# EAGLE schematic ESP32_School_Prototype (EAGLE 9.2.2)

## Sheet 1 of 8: ESP32
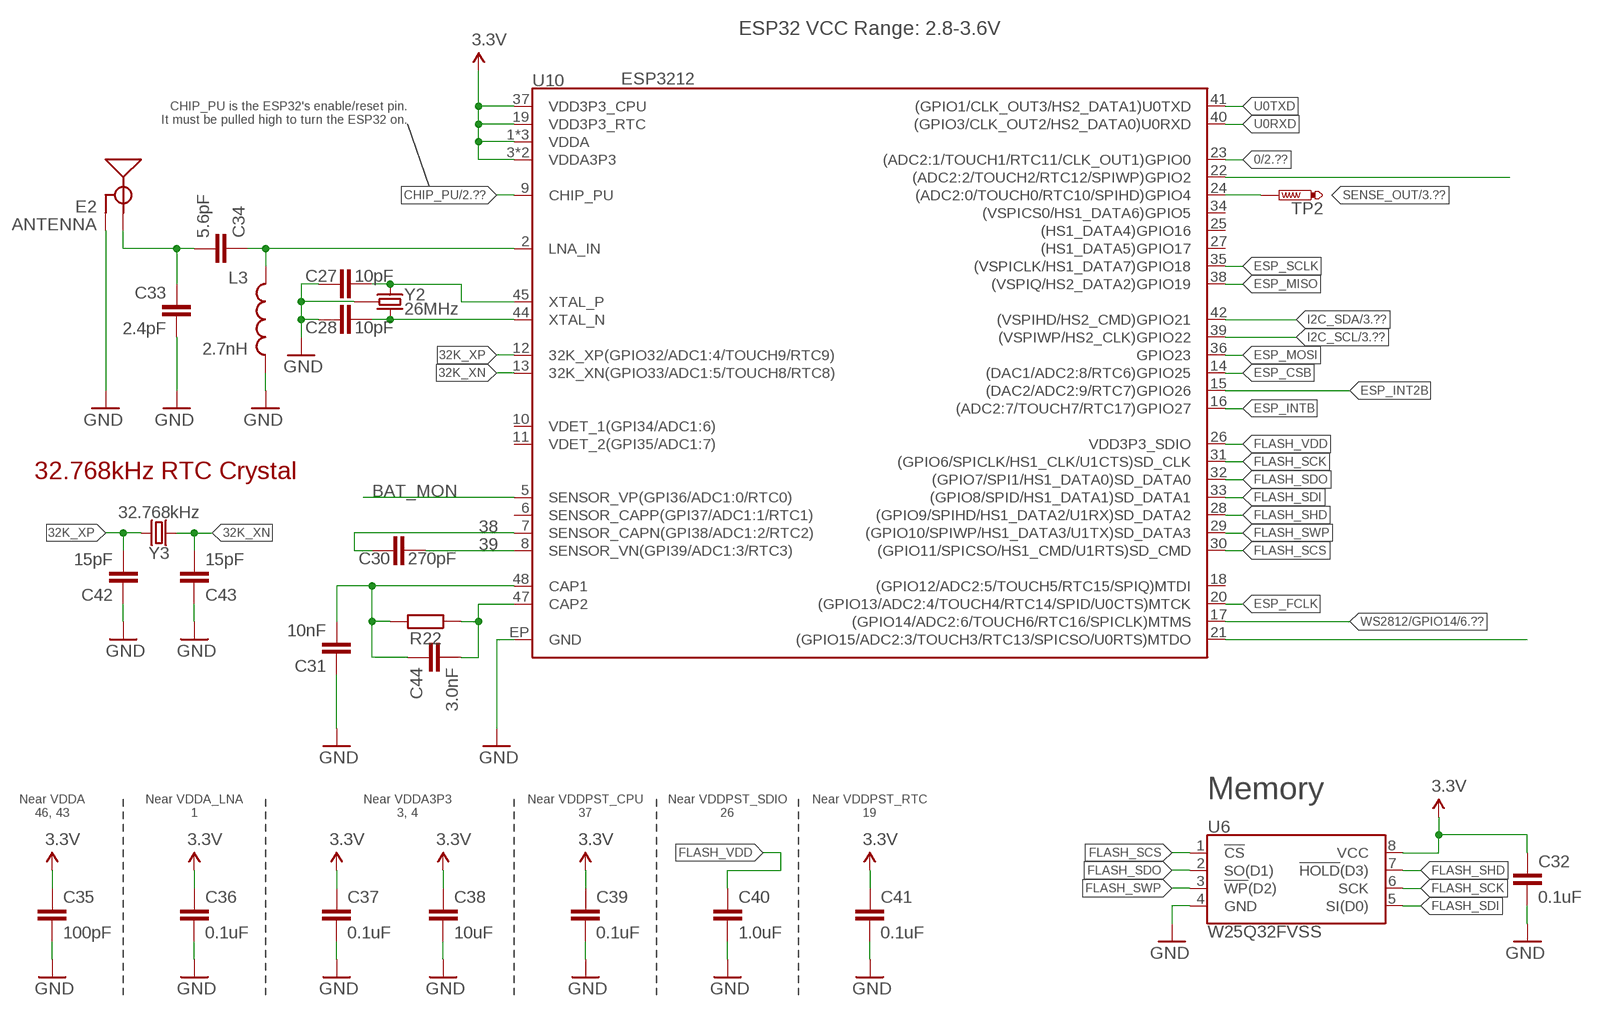
[diagram p0: schematic, sheet 1]

### Parts
C27  10pF  10PF-0603-50V-5%  [0603]
C28  10pF  10PF-0603-50V-5%  [0603]
C30  270pF  270PF-50V-5%(0603)  [0603]
C31  10nF  10NF-0603-50V-10%  [0603]
C32  0.1uF  0.1UF-0402-16V-10%  [0402]
C33  2.4pF  2.4PF-0603-50V-5%  [0603]
C34  5.6pF  5.6PF-50V-5%(0603)  [0603]
C35  100pF  100PF-0603-50V-5%  [0603]
C36  0.1uF  0.1UF-0603-25V-(+80/-20%)  [0603]
C37  0.1uF  0.1UF-0603-25V-(+80/-20%)  [0603]
C38  10uF  10UF-0603-6.3V-20%  [0603]
C39  0.1uF  0.1UF-0402-16V-10%  [0402]
C40  1.0uF  1.0UF-0603-16V-10%  [0603]
C41  0.1uF  0.1UF-0603-25V-(+80/-20%)  [0603]
C42  15pF  15PF-0603-50V-5%  [0603]
C43  15pF  15PF-0603-50V-5%  [0603]
C44  3.0nF  3.0NF-0603-50V-5%  [0603]
E2  ANTENNA  ANTENNATRACE-TUNED  [TRACE_ANTENNA_2.4GHZ_25.7MM_TUNED]
L3  2.7nH  INDUCTOR0603  [0603]
R22  20k  R-EU_R0402  [R0402]
TP2  PTR1TP10SQ  [TP10SQ]
U6  W25Q32FVSS  [SOIC-8]
U10  ESP3212  [QFN48-0.4MM]
Y2  26MHz  CRYSTAL-GROUNDED3.2X2.5  [CRYSTAL-SMD-3.2X2.5]
Y3  32.768kHz  CRYSTAL-32.768KHZSMD-3.2X1.5  [CRYSTAL-SMD-3.2X1.5MM]

### Nets
0: U10.23((ADC2:1/TOUCH1/RTC11/CLK_OUT1)GPIO0) ; also sheet 2
3.3V: C32.1 C35.1 C36.1 C37.1 C38.1 C39.1 C41.1 U6.8(VCC) U10.1(VDDA) U10.3(VDDA3P3) U10.4(VDDA3P3) U10.19(VDD3P3_RTC) U10.37(VDD3P3_CPU) U10.43(VDDA) U10.46(VDDA) ; also sheet 2,3,4,5,6,7
32K_XN: C43.2 U10.13(32K_XN(GPIO33/ADC1:5/TOUCH8/RTC8)) Y3.P$2
32K_XP: C42.2 U10.12(32K_XP(GPIO32/ADC1:4/TOUCH9/RTC9)) Y3.P$1
38: C30.1 U10.7(SENSOR_CAPN(GPI38/ADC1:2/RTC2))
39: C30.2 U10.8(SENSOR_VN(GPI39/ADC1:3/RTC3))
BAT_MON: U10.5(SENSOR_VP(GPI36/ADC1:0/RTC0)) ; also sheet 5
CAP_10N: C31.2 C44.1 R22.2 U10.48(CAP1)
CHIP_PU: U10.9(CHIP_PU) ; also sheet 2
ESP_CSB: U10.14((DAC1/ADC2:8/RTC6)GPIO25)
ESP_FCLK: U10.20((GPIO13/ADC2:4/TOUCH4/RTC14/SPID/U0CTS)MTCK)
ESP_INT2B: U10.15((DAC2/ADC2:9/RTC7)GPIO26)
ESP_INTB: U10.16((ADC2:7/TOUCH7/RTC17)GPIO27)
ESP_MISO: U10.38((VSPIQ/HS2_DATA2)GPIO19)
ESP_MOSI: U10.36(GPIO23)
ESP_SCLK: U10.35((VSPICLK/HS1_DATA7)GPIO18)
FLASH_SCK: U6.6(SCK) U10.31((GPIO6/SPICLK/HS1_CLK/U1CTS)SD_CLK)
FLASH_SCS: U6.1(!CS!) U10.30((GPIO11/SPICSO/HS1_CMD/U1RTS)SD_CMD)
FLASH_SDI: U6.5(SI(D0)) U10.33((GPIO8/SPID/HS1_DATA1)SD_DATA1)
FLASH_SDO: U6.2(SO(D1)) U10.32((GPIO7/SPI1/HS1_DATA0)SD_DATA0)
FLASH_SHD: U6.7(!HOLD!(D3)) U10.28((GPIO9/SPIHD/HS1_DATA2/U1RX)SD_DATA2)
FLASH_SWP: U6.3(!WP!(D2)) U10.29((GPIO10/SPIWP/HS1_DATA3/U1TX)SD_DATA3)
FLASH_VDD: C40.1 U10.26(VDD3P3_SDIO)
GND: C27.1 C28.1 C31.1 C32.2 C33.2 C35.2 C36.2 C37.2 C38.2 C39.2 C40.2 C41.2 C42.1 C43.1 E2.GND E2.GND2(GND) L3.2 U6.4(GND) U10.EP(GND) Y2.2(GND) Y2.4(GND) ; also sheet 3,4,5,6,7,8
I2C_SCL: U10.39((VSPIWP/HS2_CLK)GPIO22) ; also sheet 3
I2C_SDA: U10.42((VSPIHD/HS2_CMD)GPIO21) ; also sheet 3
LNA_IN: C34.1 L3.1 U10.2(LNA_IN)
N$4: U10.22((ADC2:2/TOUCH2/RTC12/SPIWP)GPIO2)
N$15: U10.21((GPIO15/ADC2:3/TOUCH3/RTC13/SPICSO/U0RTS)MTDO)
N$25: C27.2 U10.45(XTAL_P) Y2.1
N$26: C28.2 U10.44(XTAL_N) Y2.3
N$30: C44.2 R22.1 U10.47(CAP2)
SENSE_OUT: TP2.TP U10.24((ADC2:0/TOUCH0/RTC10/SPIHD)GPIO4) ; also sheet 3
TRACE_ANT1: C33.1 C34.2 E2.ANT(SIGNAL)
U0RXD: U10.40((GPIO3/CLK_OUT2/HS2_DATA0)U0RXD) ; also sheet 7
U0TXD: U10.41((GPIO1/CLK_OUT3/HS2_DATA1)U0TXD) ; also sheet 7
WS2812/GPIO14: U10.17((GPIO14/ADC2:6/TOUCH6/RTC16/SPICLK)MTMS) ; also sheet 6
Unconnected: U10.6(SENSOR_CAPP(GPI37/ADC1:1/RTC1)) U10.10(VDET_1(GPI34/ADC1:6)) U10.11(VDET_2(GPI35/ADC1:7)) U10.18((GPIO12/ADC2:5/TOUCH5/RTC15/SPIQ)MTDI) U10.25((HS1_DATA4)GPIO16) U10.27((HS1_DATA5)GPIO17) U10.34((VSPICS0/HS1_DATA6)GPIO5)

### Notes on the sheet
- ESP32 VCC Range: 2.8-3.6V
- CHIP_PU is the ESP32's enable/reset pin.
  It must be pulled high to turn the ESP32 on.
- 32.768kHz RTC Crystal
- Memory
- Near VDDA
  46, 43
- Near VDDA_LNA
  1
- Near VDDA3P3
  3, 4
- Near VDDPST_CPU
  37
- Near VDDPST_SDIO
  26
- Near VDDPST_RTC
  19

## Sheet 2 of 8: ESP32 BOOT CONFIG
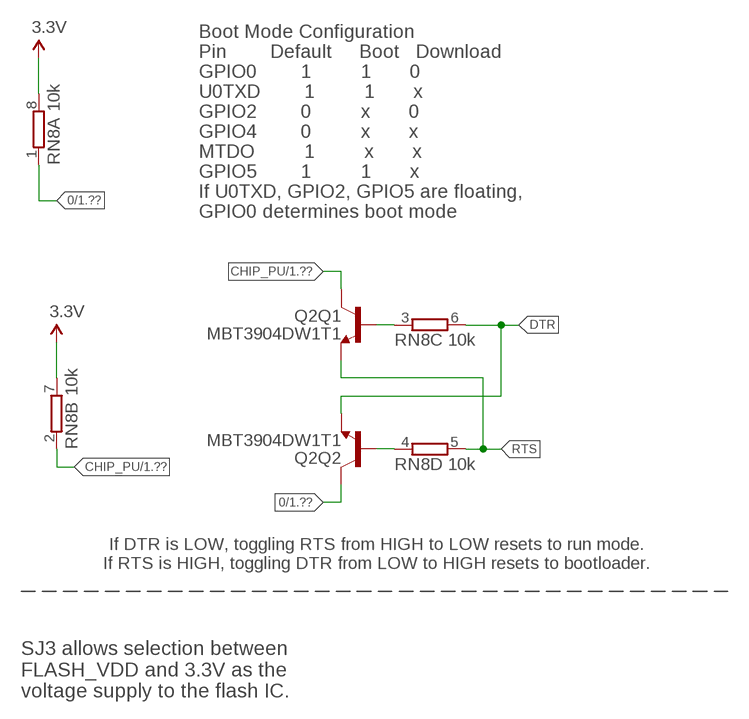
[diagram p1: schematic, sheet 2]

### Parts
Q2  MBT3904DW1T1  [SC70-6]
RN8  10k  4R-N0603-ARC  [0603-ARC]

### Nets
0: Q2.6(Q2:C) RN8.1 ; also sheet 1
3.3V: RN8.7 RN8.8 ; also sheet 1,3,4,5,6,7
CHIP_PU: Q2.3(Q1:C) RN8.2 ; also sheet 1
DTR: Q2.1(Q2:E) RN8.6 ; also sheet 7
N$5: Q2.5(Q1:B) RN8.3
N$7: Q2.2(Q2:B) RN8.4
RTS: Q2.4(Q1:E) RN8.5 ; also sheet 7

### Notes on the sheet
- Boot Mode Configuration
  Pin        Default     Boot   Download
  GPIO0        1         1       0
  U0TXD        1         1       x
  GPIO2        0         x       0
  GPIO4        0         x       x
  MTDO         1         x       x
  GPIO5        1         1       x
  If U0TXD, GPIO2, GPIO5 are floating, 
  GPIO0 determines boot mode
- If DTR is LOW, toggling RTS from HIGH to LOW resets to run mode.
  If RTS is HIGH, toggling DTR from LOW to HIGH resets to bootloader.
- SJ3 allows selection between 
  FLASH_VDD and 3.3V as the
  voltage supply to the flash IC.

## Sheet 3 of 8: SENSORS
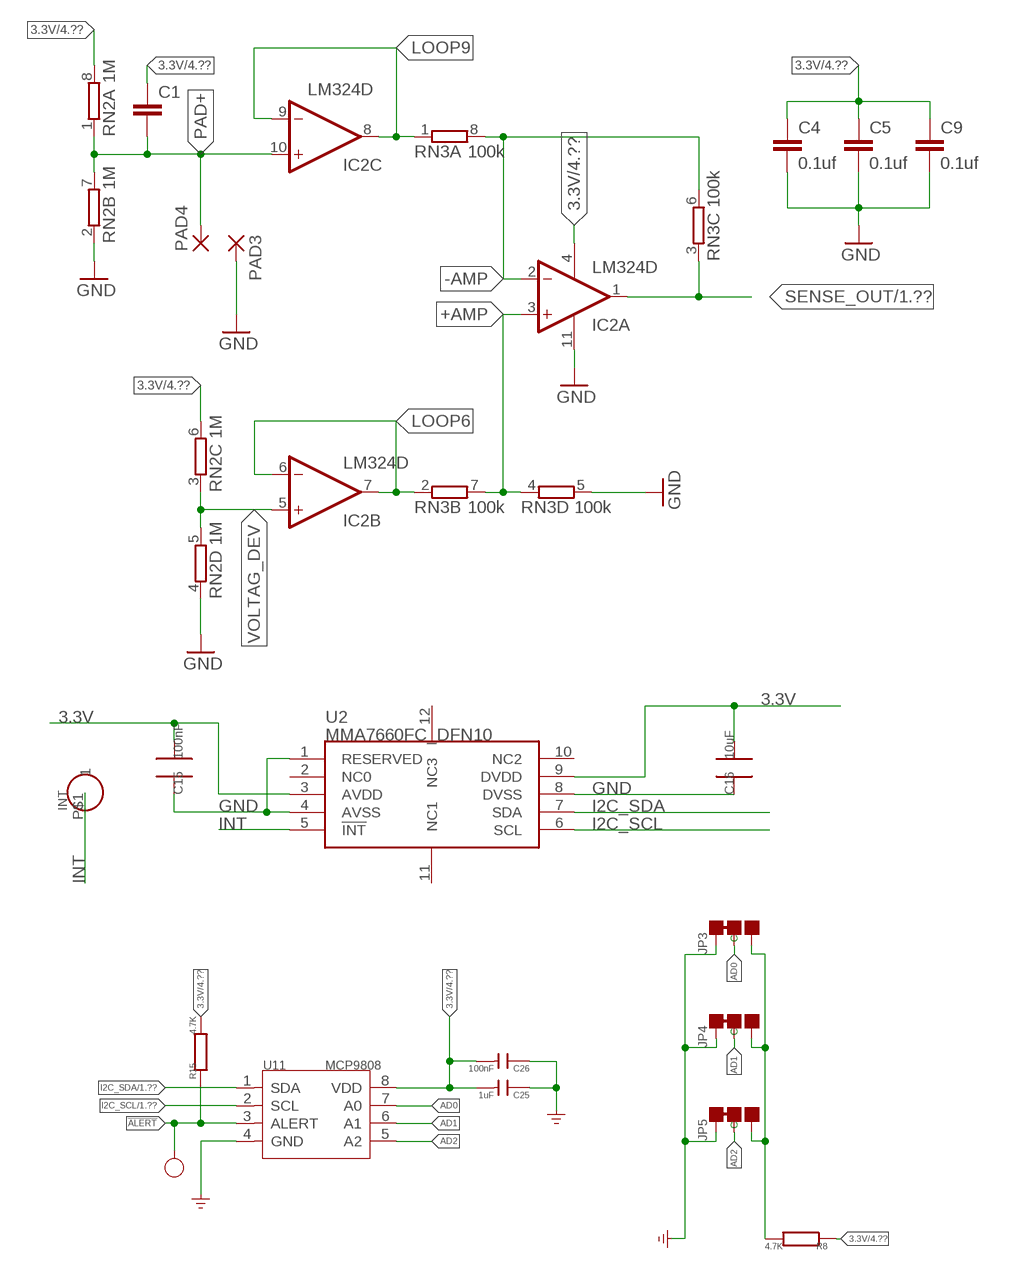
[diagram p2: schematic, sheet 3]

### Parts
C1  C-EUC0603K  [C0603K]
C4  0.1uf  C-EUC0603K  [C0603K]
C5  0.1uf  C-EUC0603K  [C0603K]
C9  0.1uf  C-EUC0603K  [C0603K]
C15  100nF  C0603_S  [0603_S]
C16  10uF  C0805_S  [0805_S]
C25  1uF  C-0603  [C0603]
C26  100nF  C-0603  [C0603]
GND16  TEST-POINT'4545'  [TP-D45MIL]
IC2  LM324D  [SO14]
INT  HEADER-1P-35  [1P-65/35MIL]
JP3  JP-3P-SHORT  [3P-SMD-SHORT]
JP4  JP-3P-SHORT  [3P-SMD-SHORT]
JP5  JP-3P-SHORT  [3P-SMD-SHORT]
PAD3  2,54/1,1  [2,54/1,1]
PAD4  2,54/1,1  [2,54/1,1]
R8  4.7K  R-EU_R0402  [R0402]
R15  4.7K  R-EU_R0402  [R0402]
RN2  1M  4R-N0603-ARV  [0603-ARV]
RN3  100k  4R-N0603-ARV  [0603-ARV]
U2  MMA7660FC_DFN10  [DFN10]
U11  MCP9808  SENSOR-MCP9808  [MSOP8-0.65-3X3X0.85MM]

### Nets
3.3V: C1.1 C4.1 C5.1 C9.1 C15.2 C16.2 C25.2 C26.2 IC2.4(P:V+) R8.1 R15.2 RN2.6 RN2.8 U2.3(AVDD) U2.9(DVDD) U11.8(VDD) ; also sheet 1,2,4,5,6,7
!ALERT: GND16.T R15.1 U11.3(ALERT)
+AMP: IC2.3(A:+IN) RN3.4 RN3.7
-AMP: IC2.2(A:-IN) RN3.6 RN3.8
AD0: JP3.MM(C) U11.7(A0)
AD1: JP4.MM(C) U11.6(A1)
AD2: JP5.MM(C) U11.5(A2)
GND: C4.2 C5.2 C9.2 C15.1 C16.1 C25.1 C26.1 IC2.11(P:V-) JP3.11(L) JP4.11(L) JP5.11(L) PAD3.1(P) RN2.2 RN2.4 RN3.5 U2.1(RESERVED) U2.4(AVSS) U2.8(DVSS) U11.4(GND) ; supply symbol labelled GND_POWER ; also sheet 1,4,5,6,7,8
I2C_SCL: U2.6(SCL) U11.2(SCL) ; also sheet 1
I2C_SDA: U2.7(SDA) U11.1(SDA) ; also sheet 1
INT: INT.P$1 U2.5(!INT)
LOOP6: IC2.6(B:-IN) IC2.7(B:OUT) RN3.2
LOOP9: IC2.8(C:OUT) IC2.9(C:-IN) RN3.1
N$13: JP3.00(R) JP4.00(R) JP5.00(R) R8.2
PAD+: C1.2 IC2.10(C:+IN) PAD4.1(P) RN2.1 RN2.7
SENSE_OUT: IC2.1(A:OUT) RN3.3 ; also sheet 1
VOLTAG_DEV: IC2.5(B:+IN) RN2.3 RN2.5
Unconnected: IC2.12(D:+IN) IC2.13(D:-IN) IC2.14(D:OUT) U2.2(NC0) U2.10(NC2) U2.11(NC1) U2.12(NC3)

## Sheet 4 of 8: TEST SENSORS
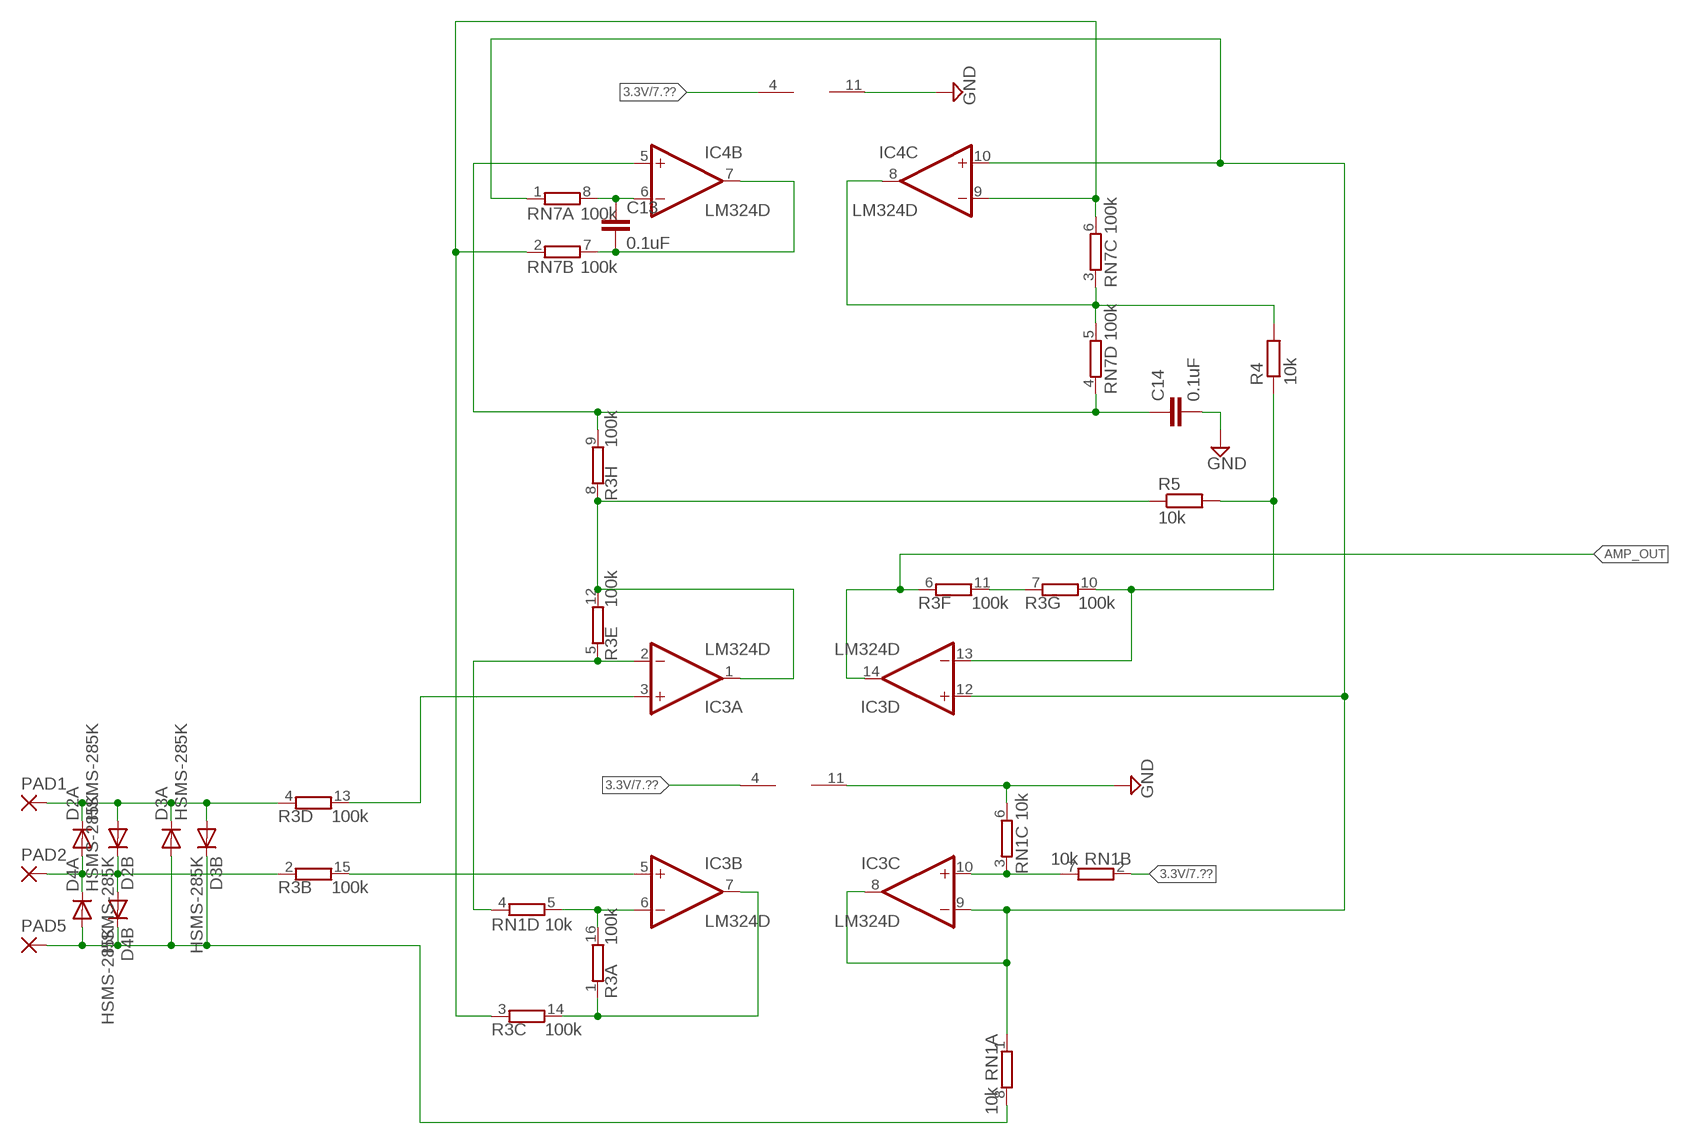
[diagram p3: schematic, sheet 4]

### Parts
C13  0.1uF  0.1UF-0402-16V-10%  [0402]
C14  0.1uF  0.1UF-0402-16V-10%  [0402]
D2  HSMS-285K  [SOT363]
D3  HSMS-285K  [SOT363]
D4  HSMS-285K  [SOT363]
IC3  LM324D  [SO14]
IC4  LM324D  [SO14]
PAD1  2,54/1,1  [2,54/1,1]
PAD2  2,54/1,1  [2,54/1,1]
PAD5  2,54/1,1  [2,54/1,1]
R3  100k  8R-NEXB2HV  [EXB2HV]
R4  10k  R-EU_R0603  [R0603]
R5  10k  R-EU_R0603  [R0603]
RN1  10k  4R-N0402ARV341  [4X0402ARV341]
RN7  100k  4R-N0402ARV341  [4X0402ARV341]

### Nets
3.3V: IC3.4(P:V+) IC4.4(P:V+) RN1.2 ; also sheet 1,2,3,5,6,7
AMP_OUT: IC3.14(D:OUT) R3.6
GND: C14.2 IC3.11(P:V-) IC4.11(P:V-) RN1.6 ; also sheet 1,3,5,6,7,8
N$1: D2.3(B:A) D2.6(A:C) D3.3(B:A) D3.6(A:C) PAD1.1(P) R3.4
N$9: D2.1(A:A) D2.4(B:C) D4.3(B:A) D4.6(A:C) PAD2.1(P) R3.2
N$10: D3.1(A:A) D3.4(B:C) D4.1(A:A) D4.4(B:C) PAD5.1(P) RN1.8
N$12: IC3.10(C:+IN) RN1.3 RN1.7
N$14: IC3.7(B:OUT) R3.1 R3.14
N$16: IC3.6(B:-IN) R3.16 RN1.5
N$17: IC4.9(C:-IN) R3.3 RN7.2 RN7.6
N$18: IC3.2(A:-IN) R3.5 RN1.4
N$19: IC3.5(B:+IN) R3.15
N$20: IC3.3(A:+IN) R3.13
N$21: IC3.1(A:OUT) R3.8 R3.12 R5.1
N$22: IC3.13(D:-IN) R3.10 R4.1 R5.2
N$23: IC4.8(C:OUT) R4.2 RN7.3 RN7.5
N$24: R3.7 R3.11
N$29: C14.1 IC4.5(B:+IN) R3.9 RN7.4
N$31: C13.1 IC4.6(B:-IN) RN7.8
N$32: IC3.8(C:OUT) IC3.9(C:-IN) IC3.12(D:+IN) IC4.10(C:+IN) RN1.1 RN7.1
N$33: C13.2 IC4.7(B:OUT) RN7.7
Unconnected: IC4.1(A:OUT) IC4.2(A:-IN) IC4.3(A:+IN) IC4.12(D:+IN) IC4.13(D:-IN) IC4.14(D:OUT)

## Sheet 5 of 8: POWER REGULATORS
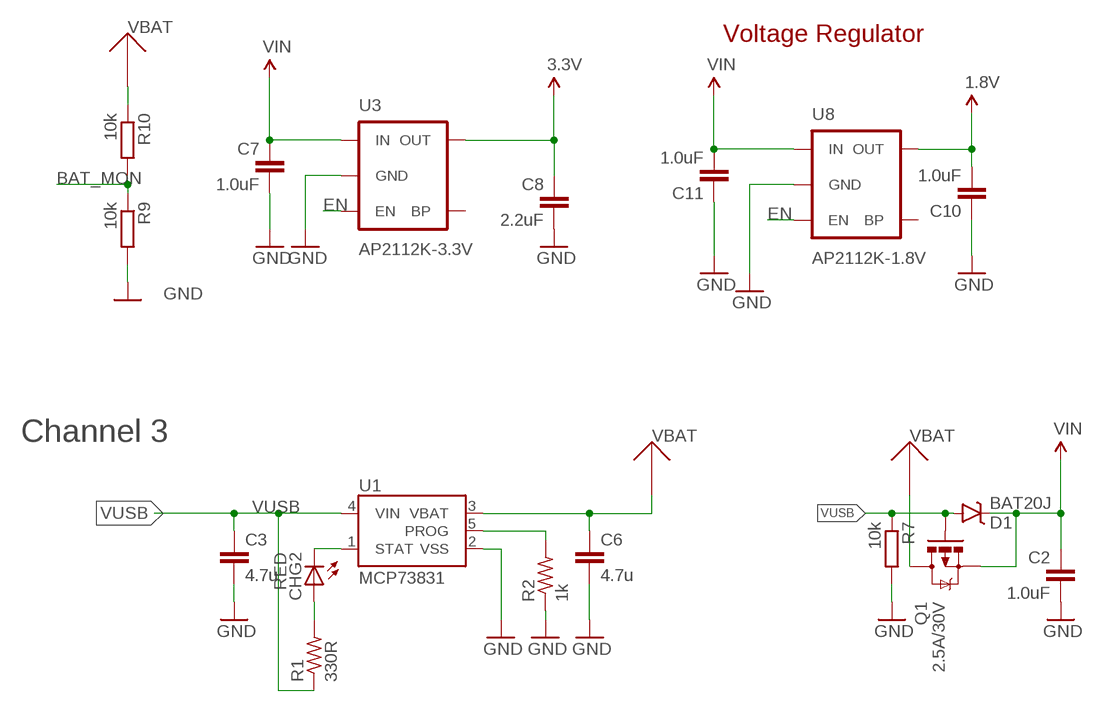
[diagram p4: schematic, sheet 5]

### Parts
C2  1.0uF  C-EUC0402  [C0402]
C3  4.7u  C-EUC0805  [C0805]
C6  4.7u  C-EUC0805  [C0805]
C7  1.0uF  1.0UF-25V-+80/-20(0805)  [0805]
C8  2.2uF  C-EUC0805  [C0805]
C10  1.0uF  C-EUC0805  [C0805]
C11  1.0uF  C-EUC0805  [C0805]
CHG2  RED  LEDCHIPLED_0603  [CHIPLED_0603]
D1  BAT20J  DIODE-SCHOTTKY-BAT20J  [SOD-323]
Q1  2.5A/30V  MOSFET-PCHANNELDMG2307L  [SOT23-3]
R1  330R  R-US_R0402  [R0402]
R2  1k  R-US_R0402  [R0402]
R7  10k  R-EU_R0402  [R0402]
R9  10k  R-EU_R0402  [R0402]
R10  10k  R-EU_R0402  [R0402]
U1  MCP73831  [SOT23-5]
U3  AP2112K-3.3V  V_REG_LDOSMD  [SOT23-5]
U8  AP2112K-1.8V  V_REG_LDOSMD  [SOT23-5]

### Nets
1.8V: C10.2 U8.5(OUT)
3.3V: C8.1 U3.5(OUT) ; also sheet 1,2,3,4,6,7
BAT_MON: R9.1 R10.2 ; also sheet 1
EN: U3.3(EN) U8.3(EN) ; also sheet 6
GND: C2.2 C3.2 C6.2 C7.2 C8.2 C10.1 C11.1 R2.1 R7.2 R9.2 U1.2(VSS) U3.2(GND) U8.2(GND) ; also sheet 1,3,4,6,7,8
N$2: CHG2.C U1.1(STAT)
N$3: CHG2.A R1.2
N$6: R2.2 U1.5(PROG)
VBAT: C6.1 Q1.3(D) R10.1 U1.3(VBAT) ; also sheet 6
VIN: C2.1 C7.1 C11.2 D1.C Q1.2(S) U3.1(IN) U8.1(IN) ; also sheet 6
VUSB: C3.1 D1.A Q1.1(G) R1.1 R7.1 U1.4(VIN) ; also sheet 7
Unconnected: U3.4(BP) U8.4(BP)

### Notes on the sheet
- Voltage Regulator
- Channel 3

## Sheet 6 of 8: CONNECTORS
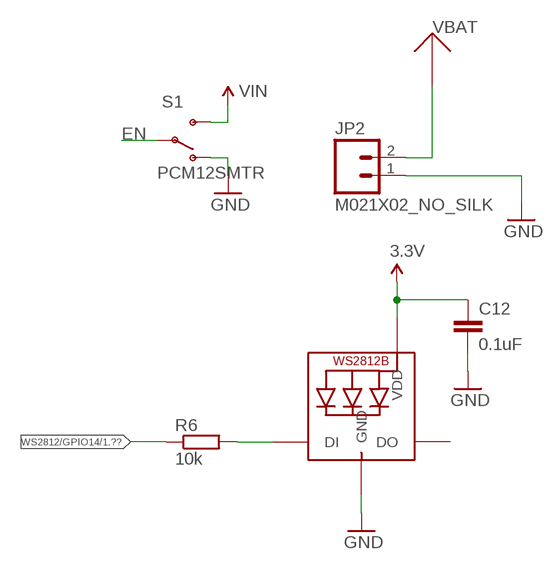
[diagram p5: schematic, sheet 6]

### Parts
C12  0.1uF  0.1UF-0603-25V-(+80/-20%)  [0603]
JP2  M021X02_NO_SILK  [1X02_NO_SILK]
LED2  WS2812B5050  [WS2812B]
R6  10k  R-EU_R0402  [R0402]
S1  PCM12SMTR  SWITCH-SPDT-SMD-A  [SWITCH-SPST-SMD-A]

### Nets
3.3V: C12.1 LED2.1-VDD(VDD) ; also sheet 1,2,3,4,5,7
EN: S1.2(P) ; also sheet 5
GND: C12.2 JP2.1 LED2.3-GND(GND) S1.1(O) ; also sheet 1,3,4,5,7,8
N$8: LED2.4-DIN(DI) R6.2
VBAT: JP2.2 ; also sheet 5
VIN: S1.3(S) ; also sheet 5
WS2812/GPIO14: R6.1 ; also sheet 1
Unconnected: LED2.2-DOUT(DO)

## Sheet 7 of 8: USB-FTDI
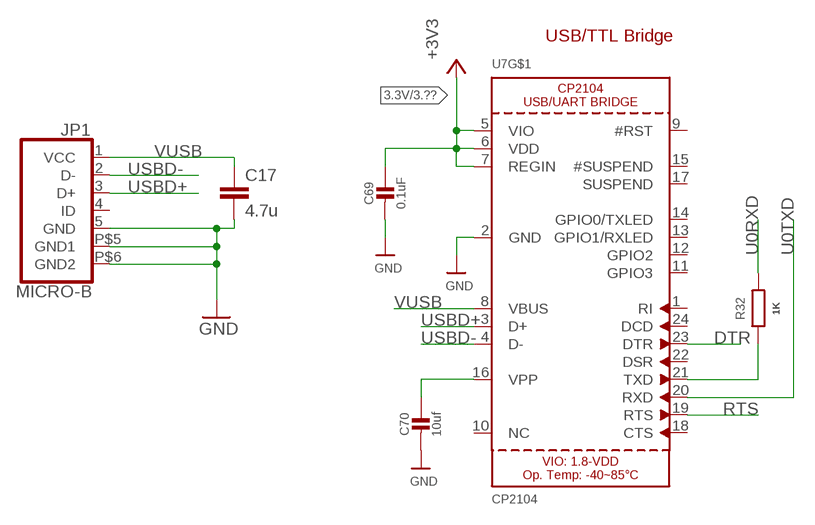
[diagram p6: schematic, sheet 7]

### Parts
C17  4.7u  C-EUC0805  [C0805]
C69  0.1uF  CAP_CERAMIC_0402  [_0402]
C70  10uf  CAP_CERAMIC0805-NOOUTLINE  [0805-NO]
JP1  MICRO-B  [MICRO-B]
R32  1K  R-EU_R0402  [R0402]
U7  CP2104  [QFN24_4MM_SMSC]

### Nets
3.3V: C69.1 U7.5(VIO) U7.6(VDD) U7.7(REGIN) ; supply symbol labelled +3V3 ; also sheet 1,2,3,4,5,6
DTR: U7.23(DTR) ; also sheet 2
GND: C17.2 C69.2 C70.2 JP1.5(GND) JP1.P$5(GND1) JP1.P$6(GND2) U7.2(GND) ; also sheet 1,3,4,5,6,8
N$27: R32.1 U7.21(TXD)
N$28: C70.1 U7.16(VPP)
RTS: U7.19(RTS) ; also sheet 2
U0RXD: R32.2 ; also sheet 1
U0TXD: U7.20(RXD) ; also sheet 1
USBD+: JP1.3(D+) U7.3(D+)
USBD-: JP1.2(D-) U7.4(D-)
VUSB: C17.1 JP1.1(VCC) U7.8(VBUS) ; also sheet 5
Unconnected: JP1.4(ID) U7.1(RI) U7.9(#RST) U7.10(NC) U7.11(GPIO3) U7.12(GPIO2) U7.13(GPIO1/RXLED) U7.14(GPIO0/TXLED) U7.15(#SUSPEND) U7.17(SUSPEND) U7.18(CTS) U7.22(DSR) U7.24(DCD)

### Notes on the sheet
- USB/TTL Bridge

## Sheet 8 of 8
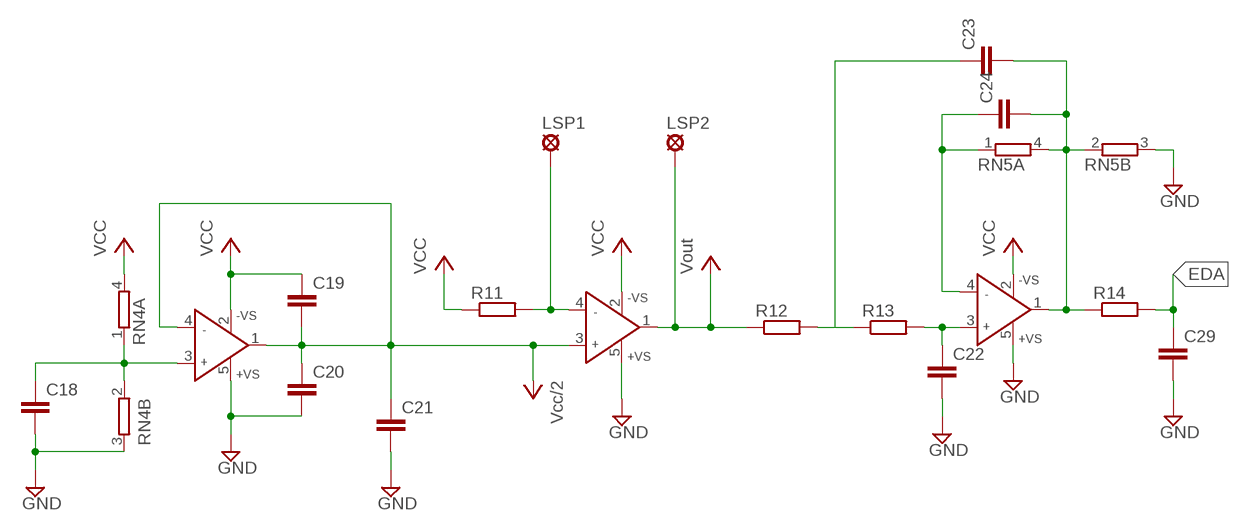
[diagram p7: schematic, sheet 8]

### Parts
C18  C-EUC0201  [C0201]
C19  C-EUC0201  [C0201]
C20  C-EUC0201  [C0201]
C21  C-EUC0201  [C0201]
C22  C-EUC0201  [C0201]
C23  C-EUC0201  [C0201]
C24  C-EUC0201  [C0201]
C29  C-EUC0201  [C0201]
IC1  AD8603UJ  [SOT23-5]
IC5  AD8603UJ  [SOT23-5]
IC6  AD8603UJ  [SOT23-5]
LSP1  MCS08  [MCS08]
LSP2  MCS08  [MCS08]
R11  R-EU_M2012  [M2012]
R12  R-EU_M2012  [M2012]
R13  R-EU_M2012  [M2012]
R14  R-EU_M2012  [M2012]
RN4  2R-NEXBV4V  [EXBV4V]
RN5  2R-NEXBV4V  [EXBV4V]

### Nets
EDA: C29.1 R14.2
GND: C18.2 C20.2 C21.2 C22.2 C29.2 IC1.5(+VS) IC5.5(+VS) IC6.5(+VS) RN4.3 RN5.3 ; also sheet 1,3,4,5,6,7
N$11: IC5.4(IN-) LSP1.MP R11.2
N$34: C18.1 IC1.3(IN+) RN4.1 RN4.2
N$37: C23.1 R12.2 R13.1
N$38: C22.1 IC6.3(IN+) R13.2
N$40: C24.1 IC6.4(IN-) RN5.1
N$41: C23.2 C24.2 IC6.1(OUT) R14.1 RN5.2 RN5.4
VCC: C19.1 C19.2 C20.1 C21.1 IC1.1(OUT) IC1.2(-VS) IC1.4(IN-) IC5.1(OUT) IC5.2(-VS) IC5.3(IN+) IC6.2(-VS) LSP2.MP R11.1 R12.1 RN4.4 ; supply symbol labelled Vout, Vcc/2

## Power pins joined to a net without a drawn wire
TP: U7.THERM(TP)

## Library data of the parts
C1 C4 C5 C9 = rcl:C-EU: CAPACITOR, European symbol; SPICEPREFIX: C
C2 C3 C6 C8 C10 C11 C17 = rcl:C-EU: CAPACITOR, European symbol
C7 = SparkFun-Capacitors:1.0UF-25V-+80/-20(0805): CAP-11625; PROD_ID: CAP-11625
C12 C36 C37 C41 = SparkFun-Capacitors:0.1UF: 0.1µF ceramic capacitors A capacitor is a passive two-terminal electrical component used to store electrical energy temporarily in an electric field.; PROD_ID: CAP-00810
C13 C14 C32 C39 = SparkFun-Capacitors:0.1UF: 0.1µF ceramic capacitors A capacitor is a passive two-terminal electrical component used to store electrical energy temporarily in an electric field.; PROD_ID: CAP-12416
C15 = CPT_SMD:C0603
C16 = CPT_SMD:C0805
C18-C24 C29 = resistor:C-EU: CAPACITOR, European symbol
C25 C26 = Discrete-small:C*: Ceramic Capacitors
C27 C28 = SparkFun-Capacitors:10PF: 10pF ceramic capacitors A capacitor is a passive two-terminal electrical component used to store electrical energy temporarily in an electric field.; PROD_ID: CAP-11812
C30 = esp32-thing-temp:270PF-50V-5%(0603): CAP-13339; PROD_ID: CAP-13339
C31 = SparkFun-Capacitors:10NF: 0.01uF/10nF/10,000pF ceramic capacitors A capacitor is a passive two-terminal electrical component used to store electrical energy temporarily in an electric field. CAP-09321; PROD_ID: CAP-00867
C33 = esp32-thing-temp:2.4PF: 2.4pF ceramic capacitors A capacitor is a passive two-terminal electrical component used to store electrical energy temporarily in an electric field.; PROD_ID: CAP-13541
C34 = esp32-thing-temp:5.6PF-50V-5%(0603): CAP-12456; PROD_ID: CAP-12456
C35 = SparkFun-Capacitors:100PF: 100pF/0.1nF ceramic capacitors A capacitor is a passive two-terminal electrical component used to store electrical energy temporarily in an electric field.; PROD_ID: CAP-07883
C38 = SparkFun-Capacitors:10UF: 10.0µF ceramic capacitors A capacitor is a passive two-terminal electrical component used to store electrical energy temporarily in an electric field.; PROD_ID: CAP-11015
C40 = SparkFun-Capacitors:1.0UF: 1µF ceramic capacitors A capacitor is a passive two-terminal electrical component used to store electrical energy temporarily in an electric field.; PROD_ID: CAP-00868
C42 C43 = SparkFun-Capacitors:15PF: 15pF ceramic capacitors A capacitor is a passive two-terminal electrical component used to store electrical energy temporarily in an electric field.; PROD_ID: CAP-07881
C44 = esp32-thing-temp:3.0NF: 3.0nF (3nF, 3000pF) ceramic capacitors A capacitor is a passive two-terminal electrical component used to store electrical energy temporarily in an electric field.; PROD_ID: CAP-13515
C69 C70 = microbuilder:CAP_CERAMIC: Ceramic Capacitors For new designs, use the packages preceded by an '_' character since they are more reliable: The following footprints should be used on most boards: _0402 - Standard footprint for regular board layouts _0603 - Standard footprint for regular board layouts _0805 - Standard footprint for regular board layouts _1206 - Standard footprint for regular board layouts For extremely tight-pitch boards where space is at a premium, the following 'micro-pitch' footprints can be used (smaller pads, no silkscreen outline, etc.): _0402MP - Micro-pitch footprint for very dense/compact boards _0603MP - Micro-pitch footprint for very dense/compact boards _0805MP - Micro-pitch footprint for very dense/compact boards _1206MP - Micro-pitch footprint for very dense/compact boards
CHG2 = led:LED: LED OSRAM: - CHIPLED LG R971, LG N971, LY N971, LG Q971, LY Q971, LO R971, LY R971 LH N974, LH R974 LS Q976, LO Q976, LY Q976 LO Q996 - Hyper CHIPLED LW Q18S LB Q993, LB Q99A, LB R99A - SideLED LS A670, LO A670, LY A670, LG A670, LP A670 LB A673, LV A673, LT A673, LW A673 LH A674 LY A675 LS A676, LA A676, LO A676, LY A676, LW A676 LS A679, LY A679, LG A679 - Hyper Micro SIDELED® LS Y876, LA Y876, LO Y876, LY Y876 LT Y87S - SmartLED LW L88C, LW L88S LB L89C, LB L89S, LG L890 LS L89K, LO L89K, LY L89K LS L896, LA L896, LO L896, LY L896 - TOPLED LS T670, LO T670, LY T670, LG T670, LP T670 LSG T670, LSP T670, LSY T670, LOP T670, LYG T670 LG T671, LOG T671, LSG T671 LB T673, LV T673, LT T673, LW T673 LH T674 LS T676, LA T676, LO T676, LY T676, LB T676, LH T676, LSB T676, LW T676 LB T67C, LV T67C, LT T67C, LS T67K, LO T67K, LY T67K, LW E67C LS E67B, LA E67B, LO E67B, LY E67B, LB E67C, LV E67C, LT E67C LW T67C LS T679, LY T679, LG T679 LS T770, LO T770, LY T770, LG T770, LP T770 LB T773, LV T773, LT T773, LW T773 LH T774 LS E675, LA E675, LY E675, LS T675 LS T776, LA T776, LO T776, LY T776, LB T776 LHGB T686 LT T68C, LB T68C - Hyper Mini TOPLED® LB M676 - Mini TOPLED Santana® LG M470 LS M47K, LO M47K, LY M47K Source: http://www.osram.convergy.de LUXEON: - LUMILED® LXK2-PW12-R00, LXK2-PW12-S00, LXK2-PW14-U00, LXK2-PW14-V00 LXK2-PM12-R00, LXK2-PM12-S00, LXK2-PM14-U00 LXK2-PE12-Q00, LXK2-PE12-R00, LXK2-PE12-S00, LXK2-PE14-T00, LXK2-PE14-U00 LXK2-PB12-K00, LXK2-PB12-L00, LXK2-PB12-M00, LXK2-PB14-N00, LXK2-PB14-P00, LXK2-PB14-Q00 LXK2-PR12-L00, LXK2-PR12-M00, LXK2-PR14-Q00, LXK2-PR14-R00 LXK2-PD12-Q00, LXK2-PD12-R00, LXK2-PD12-S00 LXK2-PH12-R00, LXK2-PH12-S00 LXK2-PL12-P00, LXK2-PL12-Q00, LXK2-PL12-R00 Source: www.luxeon.com KINGBRIGHT: KA-3528ASYC Source: www.kingbright.com
D1 = SparkFun-DiscreteSemi:DIODE-SCHOTTKY: Schottky diodes in SFE's production catalog BAT20J 1A 23V 0.62Vf RB751 120mA 40V 0.37Vf PMEG4005EJ 0.5A 40V 0.42Vf MBRA140 1A 40V 0.5Vf B340A 3A 40V SMA; PROD_ID: DIO-11623
D2-D4 = avago:HSMS-285K: Surface Mount Microwave Schottky Detector Diodes High Isolatoin Unconnected Pair Source: Data sheet <http://www.farnell.com/datasheets/461166.pdf>
E2 = esp32-thing-temp:ANTENNA: Chip antenna Chip antenna with ground or secondary connection. Common with larger metal RF connectors.
GND16 = Discrete-new:TEST-POINT; PARTNO: DNP
IC1 IC5 IC6 = analog-devices:AD8603: Precision Micropower, Low Noise CMOS, Rail-to-Rail Input/Output Operational Amplifiers Source: http://www.analog.com/static/imported-files/data_sheets/AD8603_8607_8609.pdf; MF: ALTERA CORPORATION; MPN: AD8603AUJZ-REEL7; OC_FARNELL: 1651290; OC_NEWARK: 59K6904
IC2-IC4 = linear:LM324: OP AMP
INT = Connector:HEADER-1P
JP1 = circuitects:MICRO-B
JP2 = SparkFun-Connectors:M02: Standard 2-pin 0.1" header. Use with - straight break away headers ( PRT-00116) - right angle break away headers (PRT-00553) - swiss pins (PRT-00743) - machine pins (PRT-00117) - female headers (PRT-00115) Molex polarized connector foot print use with: PRT-08233 with associated crimp pins and housings. 2.54_SCREWTERM for use with PRT-10571. 3.5mm Screw Terminal footprints for PRT-08084 5mm Screw Terminal footprints for use with PRT-08433
JP3-JP5 = Discrete-new:JP-3P-SHORT
L3 = SparkFun-Passives:INDUCTOR: Inductors Basic Inductor/Choke - 0603 and 1206. Footprints are not proven and vary greatly between part numbers. INDUCTOR POWER 3.3UH 4.0A SMD 0.197" L x 0.197" W x 0.177" H (5.00mm x 5.00mm x 4.50mm); PROD_ID: NDUC-08762
LED2 = adafruit:WS2812B
LSP1 LSP2 = solpad:MCS08: SOLDER PAD MC S0,8, drill 1.2 mm, distributor Buerklin, 08F130
PAD1-PAD5 = wirepad:2,54/1,1: THROUGH-HOLE PAD
Q1 = SparkFun-DiscreteSemi:MOSFET-PCHANNEL: Generic PMOSFET IRLML2244 - TRANS-11153 (SOT-23 -20V -4.3A) (1.Gate 2.Source 3.Drain) FQP27P06 - COM-10349 <http://www.sparkfun.com/products/10349> (TO-220 -60V -27A) (1.Gate 2.Source 3.Drain); PROD_ID: TRANS-11308
Q2 = esp32-thing-temp:MBT3904DW1T1: MBT3904DW1 Dual NPN Transistors The MBT3904W1 puts two general purpose 3904 NPN transistors in a single package. Datasheet <http://www.onsemi.com/pub_link/Collateral/MBT3904DW1T1-D.PDF>; PROD_ID: TRANS-13337
R1 R2 = rcl:R-US_: RESISTOR, American symbol
R3 = resistor-dil:8R-N: DIL RESISTOR; OC_FARNELL: unknown; OC_NEWARK: unknown
R4-R10 R15 R22 R32 = resistor:R-EU_: RESISTOR, European symbol
R11-R14 = rcl:R-EU_: RESISTOR, European symbol; SPICEPREFIX: R
RN1-RN3 RN7 RN8 = resistor-dil:4R-N: Array Chip Resistor Source: RS Component / Phycomp; OC_FARNELL: unknown; OC_NEWARK: unknown
RN4 RN5 = resistor-dil:2R-N: Array Chip Resistor Source: Panasonic; OC_FARNELL: unknown; OC_NEWARK: unknown
S1 = SparkFun-Electromechanical:SWITCH-SPDT: SPDT Switch Simple slide switch, Spark Fun Electronics SKU : COM-00102 DPDT SMT slide switch, AYZ0202, SWCH-08179; PROD_ID: SWCH-10651
TP2 = testpad:PTR1: TEST PIN
U1 = SparkFun:MCP73831: Microchip's MCP73831 Miniature single cell, fully integrated Li-Ion, Li-polymer charge management controller http://ww1.microchip.com/downloads/en/DeviceDoc/21984a.pdf
U2 = ICs_v54:MMA7660FC
U3 U8 = SparkFun-PowerIC:V_REG_LDO: Voltage Regulator LDO Standard 150mA LDO voltage regulator in SOT-23 layout. Micrel part MIC5205. BP (by-pass) pin is used to lower output noise with 470pF cap.; PROD_ID: VREG-12457
U6 = SparkFun-DigitalIC:W25Q32FV: Winbond W25Q32FV 32Mbit (4MB) Flash The W25Q32FV support the standard Serial Peripheral Interface (SPI), Dual/Quad I/O SPI as well as 2-clocks instruction cycle Quad Peripheral Interface (QPI). Datasheet <http://www.winbond.com/resource-files/w25q32fv%20revh%20091613.pdf>; PROD_ID: IC-13229
U7 = microbuilder:CP2104: CP2104 - USB to UART Bridge VDD Output: 3.45V
U10 = esp32-thing-temp:ESP3212; PROD_ID: IC-13338
U11 = Discrete-new:SENSOR-MCP9808
Y2 = things:CRYSTAL-GROUNDED; PROD_ID: XTAL-12454
Y3 = SparkFun-Clocks:CRYSTAL-32.768KHZ: 32.768kHz Crystal Frequency: 32.768kHz Frequency Stability: ±20ppm Load Capacitance: 12.5pF (PTH-2X6 & SMD-3.2X1.5), 6pF (SMD-2X6); PROD_ID: XTAL-13062

## Net classes
2 gnd: width 0.254 mm, drill 0.254 mm, clearance 0.178 mm